# EAGLE design untitled (EAGLE 9.6.2)
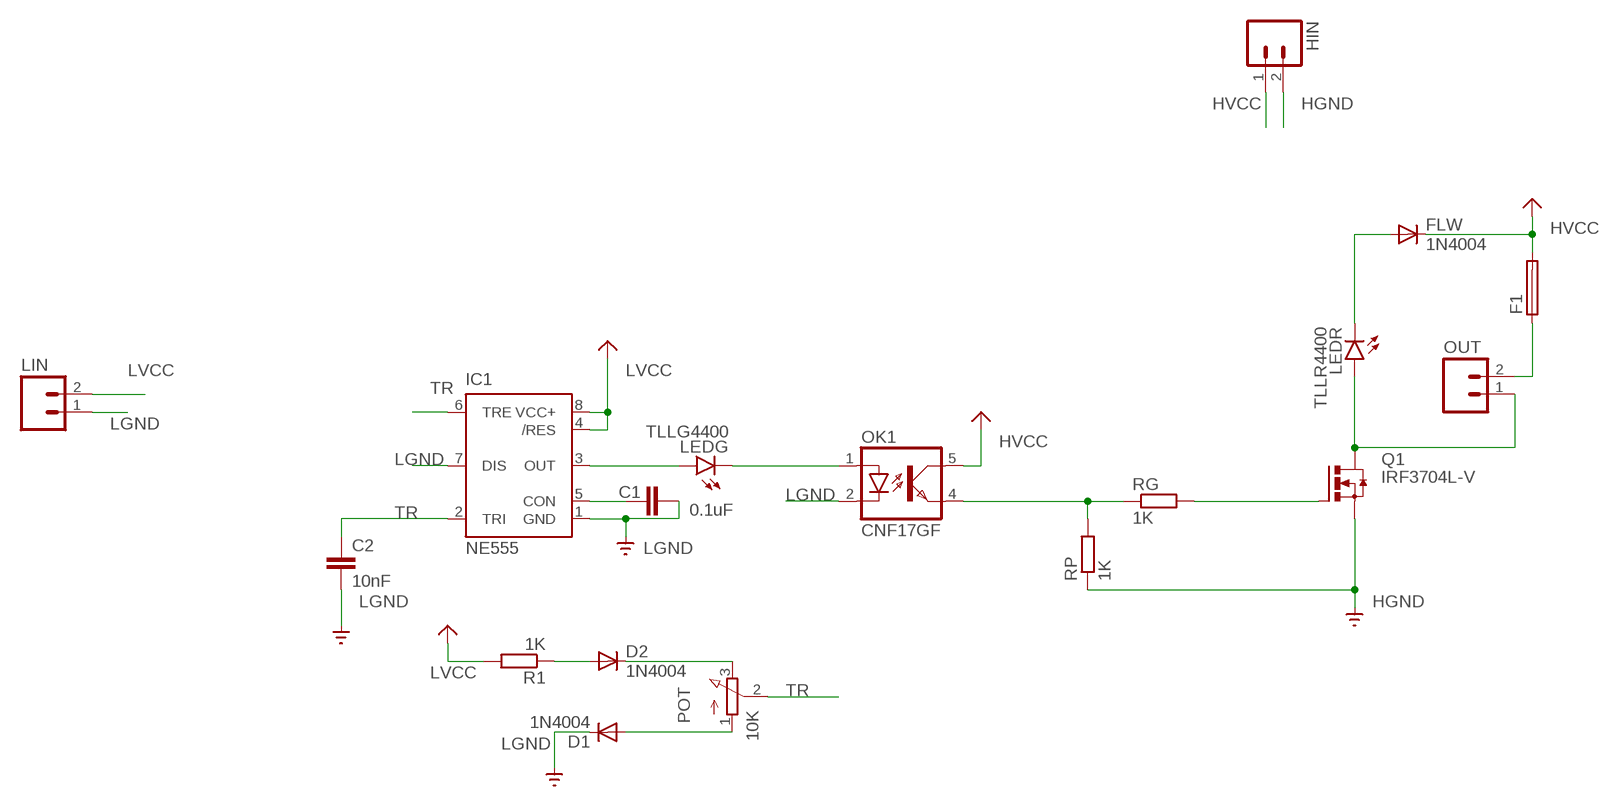
[diagram p0: schematic, sheet 1]

## Parts
C1  0.1uF  C2,5-3  [C2.5-3]
C2  10nF  C2,5-3  [C2.5-3]
D1  1N4004  [DO41-10]
D2  1N4004  [DO41-10]
F1  19559  [19559]
FLW  1N4004  [DO41-10]
HIN  M02  [02P]
IC1  NE555  [DIL-08]
LEDG  TLLG4400  [LED3MM]
LEDR  TLLR4400  [LED3MM]
LIN  M02  [02P]
OK1  CNF17GF  [DIL06B]
OUT  M02  [02P]
POT  10K  3RP/1610N  [3RP/1610N]
Q1  IRF3704L-V  [TO262-V]
R1  1K  R-EU_0204/7  [0204/7]
RG  1K  R-EU_0204/7  [0204/7]
RP  1K  R-EU_0204/7  [0204/7]

## Nets
HGND: HIN.2 Q1.3(S) RP.1 ; supply symbol labelled SUPPLY0_GND_
HVCC: F1.2 FLW.C HIN.1 OK1.5(COL) ; supply symbol labelled VCC
LGND: C1.1 C2.2 D1.C IC1.1(GND) IC1.7(DIS) LIN.1 OK1.2(C) ; supply symbol labelled SUPPLY0_GND_
LVCC: IC1.4(/RES) IC1.8(VCC+) LIN.2 R1.2 ; supply symbol labelled VCC
N$1: IC1.3(OUT) LEDG.A
N$2: LEDG.K(C) OK1.1(A)
N$3: C1.2 IC1.5(CON)
N$4: D2.C POT.3(E)
N$5: D1.A POT.1(A)
N$6: D2.A R1.1
N$7: OK1.4(EMIT) RG.1 RP.2
N$8: Q1.1(G) RG.2
N$9: LEDR.A OUT.1 Q1.2(D)
N$10: FLW.A LEDR.K(C)
N$12: F1.1 OUT.2
TR: C2.1 IC1.2(TRI) IC1.6(TRE) POT.2(S)

## Library data of the parts
C1 C2 = capacitor-wima:C: CAPACITOR naming: grid - package width
D1 D2 FLW = adafruit:1N4004: DIODE General purpose 1N400x type rectifier (With bigger pads) http://www.ladyada.net/library/pcb/eaglelibrary.html
F1 = fuse:19559: FUSE HOLDER TR5, Wickmann; MPN: 55900000001; OC_FARNELL: 9516360; OC_NEWARK: 02P0286
HIN LIN OUT = con-amp-quick:M02: AMP QUICK CONNECTOR; OC_FARNELL: unknown; OC_NEWARK: unknown
IC1 = st-microelectronics:NE555: General purpose bipolar Timer; MF: Arrow Electronics; MPN: NE555N; OC_FARNELL: 1467742; OC_NEWARK: 89K1486
LEDG = led:TLLG4400: Low Current (2mA) LED 3 mm Tinted Diffused Package color GREEN Source: Data sheet <http://www.farnell.com/datasheets/391098.pdf>; MF: VISHAY SEMICONDUCTOR; OC_FARNELL: 1612435
LEDR = led:TLLR4400: Low Current (2mA) LED 3 mm Tinted Diffused Package color RED Source: Data sheet <http://www.farnell.com/datasheets/391100.pdf>; MF: VISHAY SEMICONDUCTOR; OC_FARNELL: 1612437
OK1 = optocoupler:CNF17GF: HEWLETT PACKARD OPTO COUPLER; OC_FARNELL: unknown; OC_NEWARK: unknown
POT = pot:3RP/1610N: 16mm Potentiometer one level Source: http://www.alphapotentiometers.net/html/16mm_pot_2.html
Q1 = transistor-power:IRF3704: SMPS MOSFET HEXFET® Power MOSFET Source: http://www.irf.com/product-info/datasheets/data/irf3704.pdf
R1 RG RP = rcl:R-EU_: RESISTOR, European symbol; SPICEPREFIX: R

## Board
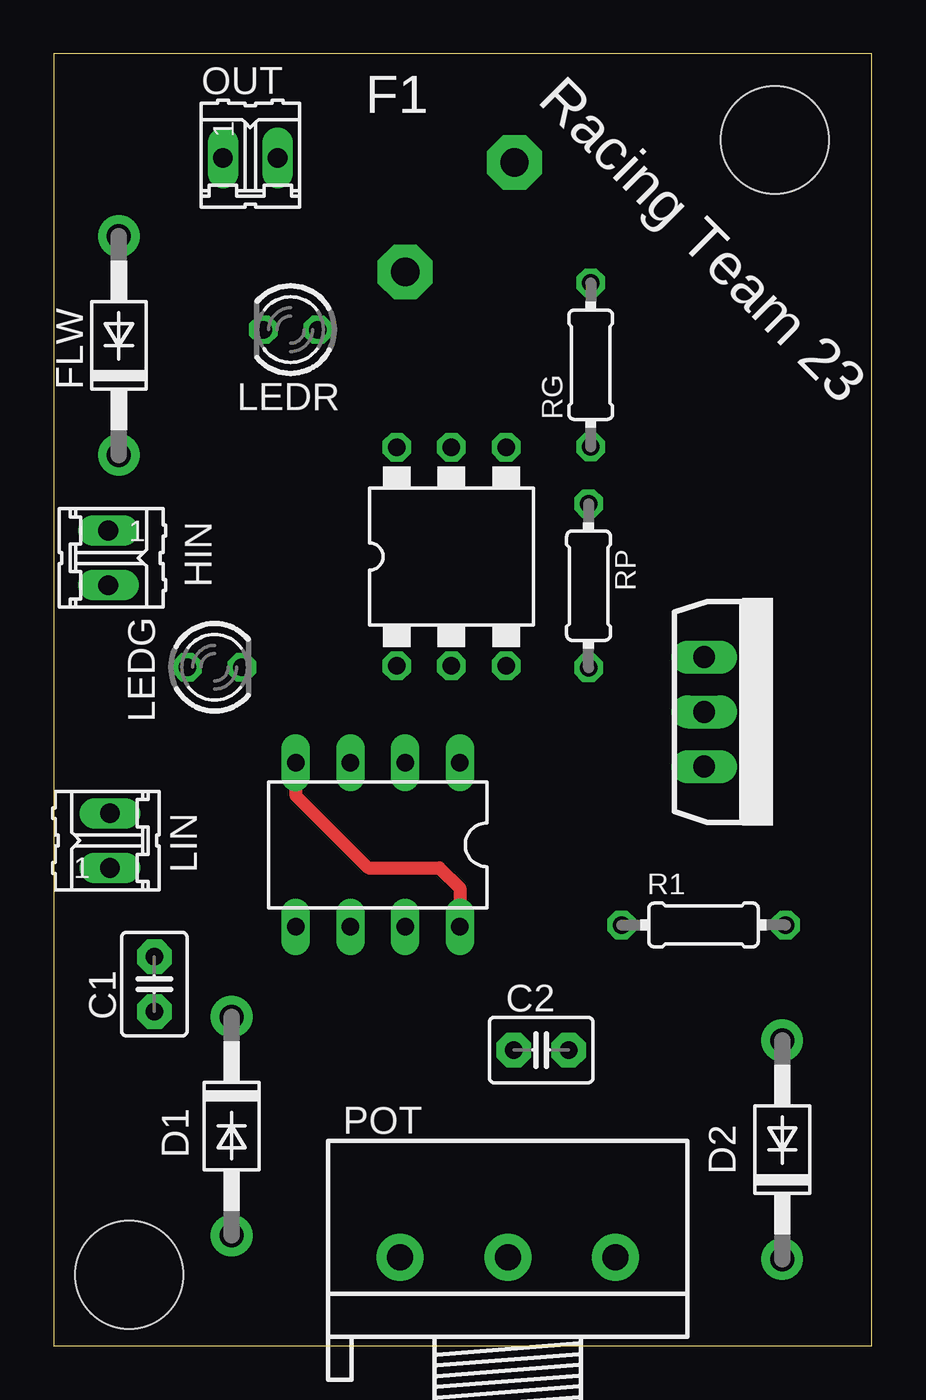
[diagram p1: board, top side]
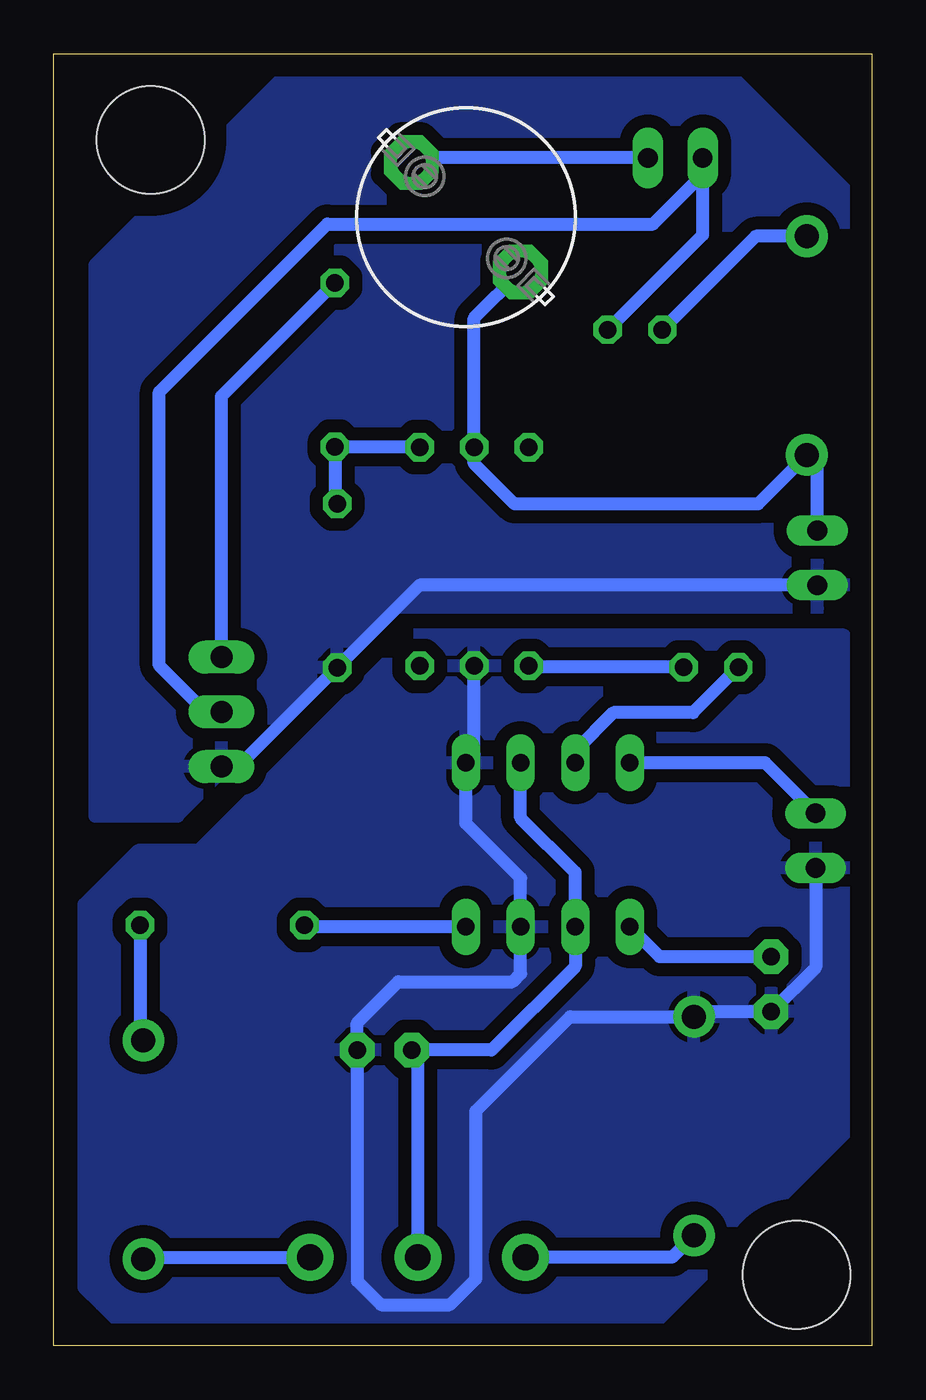
[diagram p2: board, bottom side, seen from below]

Size 38 x 60 mm. Coordinates in mm from the lower left corner, seen from the top.
Outline: 0,0 38,0 38,60 0,60 0,0
Copper layers (1*16): Top 0.035mm / dielectric 1.5mm / Bottom 0.035mm
Design rules "default *": minimum track width 0.6mm, minimum drill 0.35mm, track to track 0.6mm, track to pad 0.6mm, pad to pad 0.6mm, via to via 0.6mm, smd to smd 6mil, copper to edge 40mil, drill to drill 6mil, minimum pad ring 10mil, minimum via ring 8mil, stop-mask expansion 4mil, vias tented up to drill 0mil, thermal gap 10mil
Holes 5 mm at 33.5,56 3.5,3.3

### Footprints (pad centres in the part's own frame; a part is rotated, then mirrored left to right if it is on the bottom)
C2.5-3 = drill 0.813 pad 1.6 octagon: 1 -1.27,0; 2 1.27,0
DO41-10 = drill 1.118 pad 1.93: A 5.08,0; C -5.08,0
19559 = drill 1.321 pad 2.54 octagon: 1 -2.54,2.54; 2 2.54,-2.54
02P = drill 0.914 long: 1 -1.27,0; 2 1.27,0
DIL-08 = drill 0.813 long: 1 -3.81,-3.81; 2 -1.27,-3.81; 3 1.27,-3.81; 4 3.81,-3.81; 5 3.81,3.81; 6 1.27,3.81; 7 -1.27,3.81; 8 -3.81,3.81
LED3MM = drill 0.813 octagon: A -1.27,0; K 1.27,0
DIL06B = drill 0.813 octagon: 1 -2.54,-5.08; 2 0,-5.08; 3 2.54,-5.08; 4 2.54,5.08; 5 0,5.08; 6 -2.54,5.08
3RP/1610N = drill 1.2 pad 2.184: 1 -5,0; 2 0,0; 3 5,0
TO262-V = drill 1.016 long: 1 -2.54,0; 2 0,0; 3 2.54,0
0204/7 = drill 0.813 octagon: 1 -3.81,0; 2 3.81,0

### Placement (x,y rotation side)
C1  4.67,16.79 90 top
C2  22.64,13.73 0 top
D1  8.26,10.2 270 top
D2  33.84,9.1 90 top
F1  18.86,52.41 0 bottom
FLW  3.02,46.45 90 top
HIN  2.53,36.59 270 top
IC1  15.05,23.26 180 top
LEDG  7.47,31.51 0 top
LEDR  11,47.19 180 top
LIN  2.61,23.46 90 top
OK1  18.47,36.65 0 top
OUT  9.13,55.17 0 top
POT  21.09,4.11 0 top
Q1  30.21,29.44 270 top
R1  30.18,19.54 180 top
RG  24.94,45.56 90 top
RP  24.84,35.3 90 top

### Tracks (layer width: path | path; a pad name or v marks a point on that pad's centre or on a via)
HGND
  Bottom 0.6: Q1.3 29.43,26.9 RP.1 21.01,35.32 HIN.2
  pour Bottom: 0.9,34.3 0.9,53.4 6.4,58.9 27.4,58.9 36.1,50.2 36.1,24.6 32.24,24.6 22.54,34.3
HVCC
  Bottom 0.6: HIN.1 2.53,40.88 FLW.C 5.29,39.1 16.6,39.1 18.47,40.97 OK1.5 18.47,47.72 F1.2
LGND
  Bottom 0.6: 4.19,16 C1.1 | C1.1 8.02,15.52 D1.C 14.02,15.28 18.4,10.9 18.4,3.1 19.6,1.9 22.8,1.9 23.91,3.01 C2.2 23.91,14.99 22,16.9 16.7,16.9 16.32,17.28 IC1.7 16.32,21.72 18.86,24.26 IC1.1 18.47,27.46 OK1.2 | LIN.1 2.61,17.58 C1.1 | 4.5,15.35 C1.1
  pour Bottom: 1.4,33 21.3,33 31.3,23 34.1,23 36.6,20.5 36.6,2.7 35.8,1.9 34.8,0.9 10.8,0.9 10.2,0.9 0.3,10.8 0.3,32 1.3,33
LVCC
  Top 0.6: IC1.4 11.24,25.56 14.6,22.2 17.9,22.2 18.86,21.24 IC1.8
  Bottom 0.6: LIN.2 4.95,27.07 IC1.4 | IC1.8 26.28,19.45 R1.2
N$1
  Bottom 0.6: LEDG.A 8.31,29.4 12,29.4 13.78,27.62 IC1.3
N$2
  Bottom 0.6: LEDG.K 15.87,31.51 OK1.1
N$3
  Bottom 0.6: C1.2 9.85,18.06 IC1.5
N$4
  Bottom 0.6: D2.C 33.75,4.11 POT.3
N$5
  Bottom 0.6: D1.A 9.27,4.11 POT.1
N$6
  Bottom 0.6: R1.1 33.99,14.33 D2.A
N$7
  Bottom 0.6: RP.2 24.94,39.21 RG.1 24.92,41.73 OK1.4
N$8
  Bottom 0.6: Q1.1 30.21,44.1 RG.2
N$9
  Bottom 0.6: LEDR.A 7.86,51.6 7.86,54.4 | 7.86,54.4 OUT.1 | Q1.2 30.94,29.44 33.1,31.6 33.1,44.3 25.3,52.1 10.16,52.1 7.86,54.4
N$10
  Bottom 0.6: FLW.A 5.39,51.53 LEDR.K
N$12
  Bottom 0.6: OUT.2 21.18,55.17 F1.1
TR
  Bottom 0.6: POT.2 21.09,13.45 C2.1 17.67,13.73 13.78,17.62 IC1.6 13.78,21.98 16.32,24.52 IC1.2

### Text on the board
tNames: Racing Team 23